# Altium schematic sheet Altera_Stratix_II_Nios_II_Dev_Board.SchDoc: Altera NiosII StratixII Dev Board
size B; DocumentNumber: 1; SheetNumber: 1; SheetTotal: 1
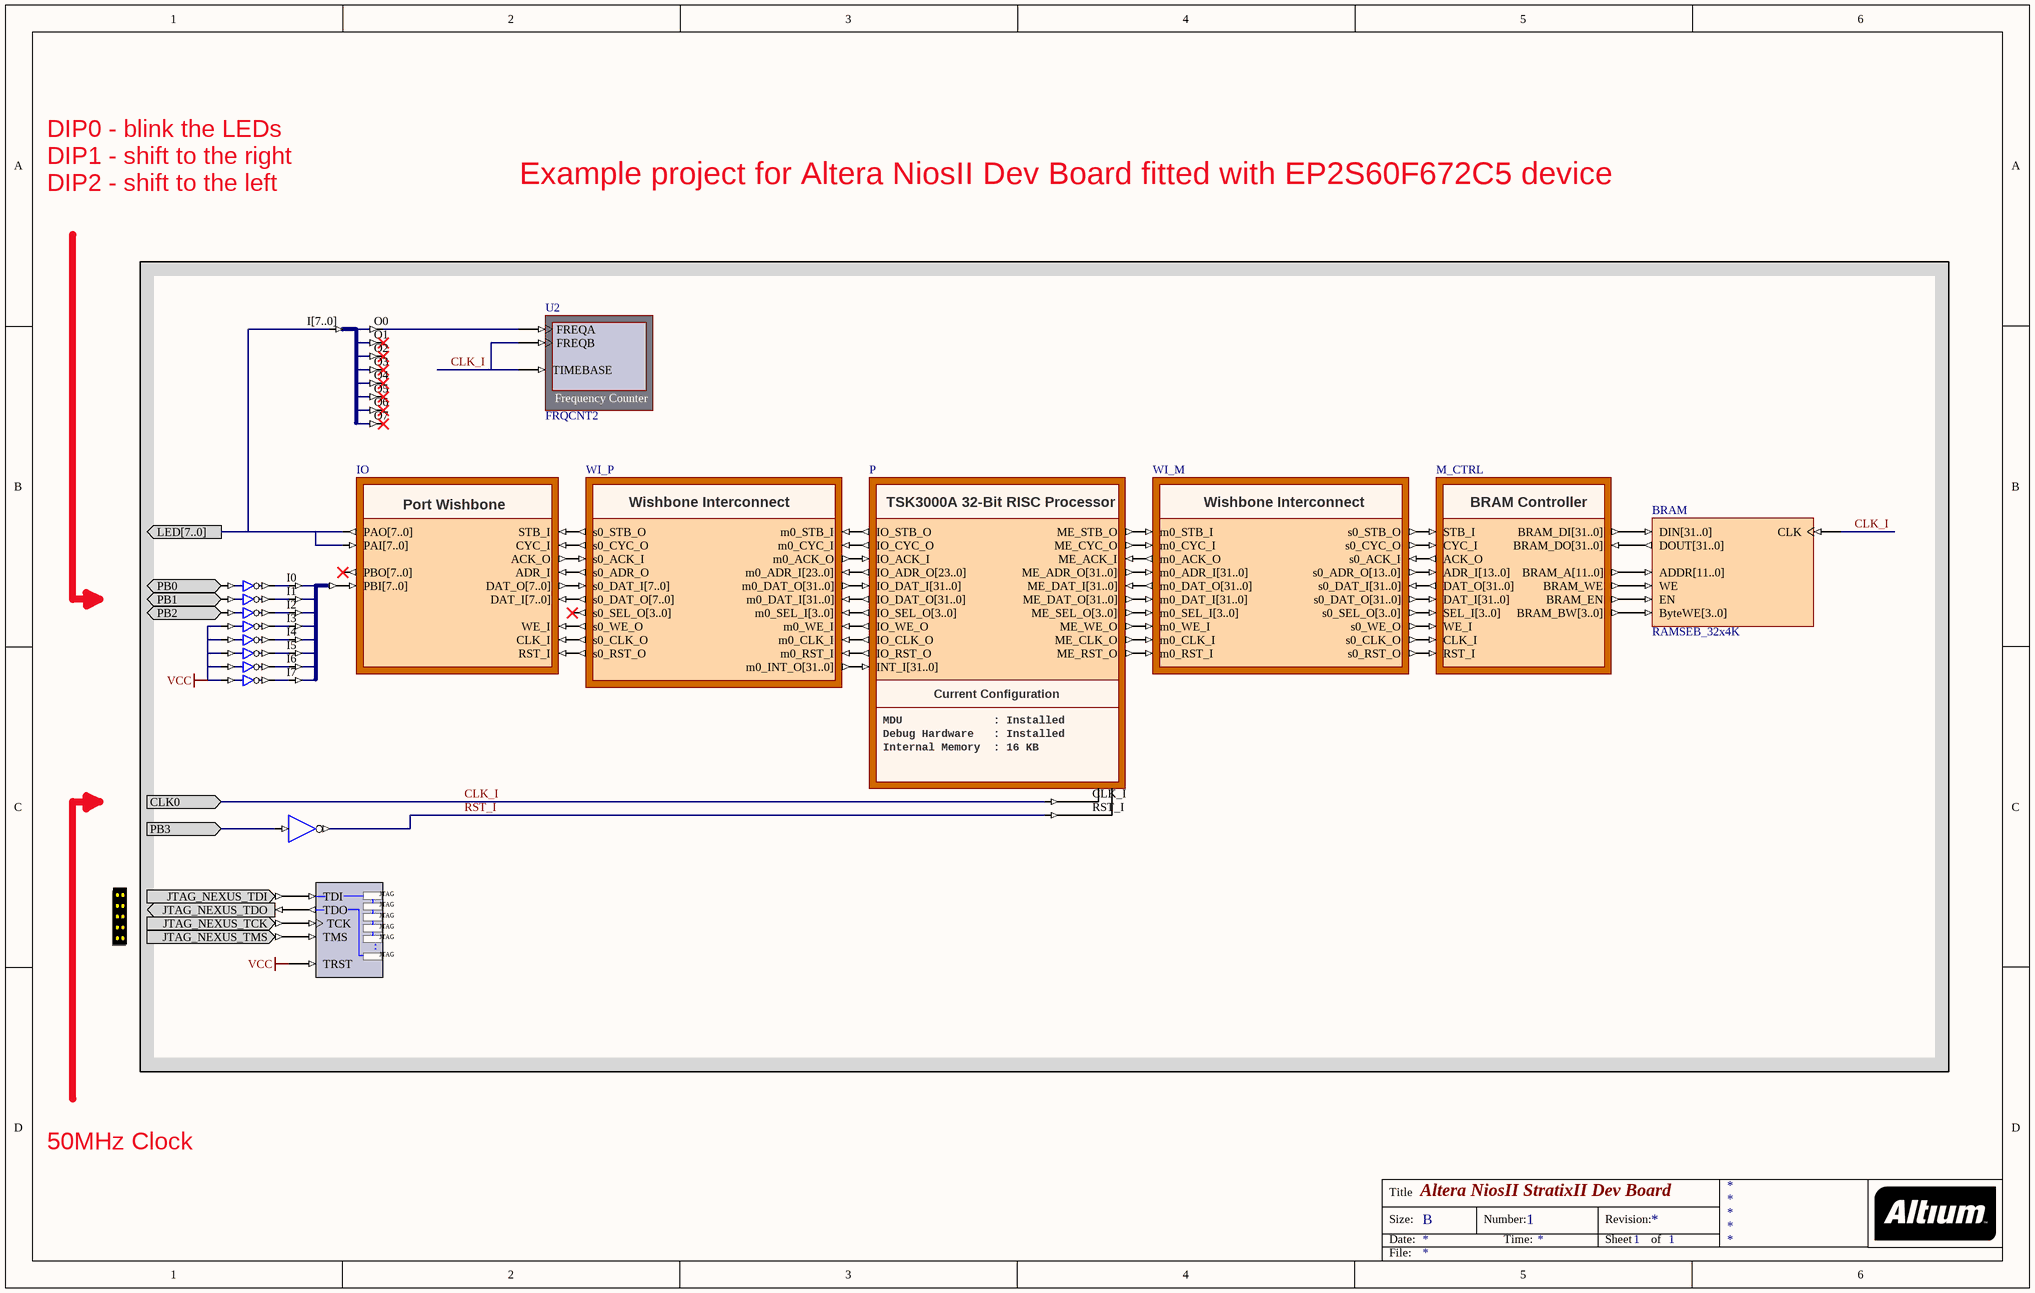
[diagram p0: Altera_Stratix_II_Nios_II_Dev_Board.SchDoc]

## Parts
?  NEXUS_JTAG_CONNECTOR  (value not drawn)
BRAM  RAMSEB_32x4K
IO  WB_PRTIO  (value not drawn)
M_CTRL  WB_MEM_CTRL  (value not drawn)
NEXUS_JTAG_PORT  NEXUS_JTAG_PORT  (value not drawn)
P  TSK3000A  (value not drawn)
U1  J8S_8B  (value not drawn)
U2  FRQCNT2
U3  J8B_8S  (value not drawn)
U4  INV  (value not drawn)
U5  INV8S  (value not drawn)
WI_M  WB_INTERCON  (value not drawn)
WI_P  WB_INTERCON  (value not drawn)

## Ports
CLK0 (in), LED[7..0] (out), PB0 (in), PB1 (in), PB2 (in), PB3 (in)

## Nets
VCC: NEXUS_JTAG_PORT.TRST U5.I3 U5.I4 U5.I5 U5.I6 U5.I7
CLK_I: BRAM.CLK P.CLK_I U2.FREQB U2.TIMEBASE ; port CLK0
LED[7..0]: IO.PAI[7..0] IO.PAO[7..0] U3.I[7..0] ; port LED[7..0]
PB0: U5.I0 ; port PB0
PB1: U5.I1 ; port PB1
PB2: U5.I2 ; port PB2
PB3: U4.I ; port PB3
RST_I: P.RST_I U4.O
Net?_JTAG_NEXUS_TCK: ?.JTAG_NEXUS_TCK NEXUS_JTAG_PORT.TCK
Net?_JTAG_NEXUS_TDI: ?.JTAG_NEXUS_TDI NEXUS_JTAG_PORT.TDI
Net?_JTAG_NEXUS_TDO: ?.JTAG_NEXUS_TDO NEXUS_JTAG_PORT.TDO
Net?_JTAG_NEXUS_TMS: ?.JTAG_NEXUS_TMS NEXUS_JTAG_PORT.TMS
NetBRAM_ADDR[11..0]: BRAM.ADDR[11..0] M_CTRL.BRAM_A[11..0]
NetBRAM_ByteWE[3..0]: BRAM.ByteWE[3..0] M_CTRL.BRAM_BW[3..0]
NetBRAM_DIN[31..0]: BRAM.DIN[31..0] M_CTRL.BRAM_DI[31..0]
NetBRAM_DOUT[31..0]: BRAM.DOUT[31..0] M_CTRL.BRAM_DO[31..0]
NetBRAM_EN: BRAM.EN M_CTRL.BRAM_EN
NetBRAM_WE: BRAM.WE M_CTRL.BRAM_WE
NetIO_ACK_O: IO.ACK_O WI_P.s0_ACK_I
NetIO_ADR_I: IO.ADR_I WI_P.s0_ADR_O
NetIO_CLK_I: IO.CLK_I WI_P.s0_CLK_O
NetIO_CYC_I: IO.CYC_I WI_P.s0_CYC_O
NetIO_DAT_I[7..0]: IO.DAT_I[7..0] WI_P.s0_DAT_O[7..0]
NetIO_DAT_O[7..0]: IO.DAT_O[7..0] WI_P.s0_DAT_I[7..0]
NetIO_PBI[7..0]: IO.PBI[7..0] U1.O[7..0]
NetIO_RST_I: IO.RST_I WI_P.s0_RST_O
NetIO_STB_I: IO.STB_I WI_P.s0_STB_O
NetIO_WE_I: IO.WE_I WI_P.s0_WE_O
NetM_CTRL_ACK_O: M_CTRL.ACK_O WI_M.s0_ACK_I
NetM_CTRL_ADR_I[13..0]: M_CTRL.ADR_I[13..0] WI_M.s0_ADR_O[13..0]
NetM_CTRL_CLK_I: M_CTRL.CLK_I WI_M.s0_CLK_O
NetM_CTRL_CYC_I: M_CTRL.CYC_I WI_M.s0_CYC_O
NetM_CTRL_DAT_I[31..0]: M_CTRL.DAT_I[31..0] WI_M.s0_DAT_O[31..0]
NetM_CTRL_DAT_O[31..0]: M_CTRL.DAT_O[31..0] WI_M.s0_DAT_I[31..0]
NetM_CTRL_RST_I: M_CTRL.RST_I WI_M.s0_RST_O
NetM_CTRL_SEL_I[3..0]: M_CTRL.SEL_I[3..0] WI_M.s0_SEL_O[3..0]
NetM_CTRL_STB_I: M_CTRL.STB_I WI_M.s0_STB_O
NetM_CTRL_WE_I: M_CTRL.WE_I WI_M.s0_WE_O
NetP_INT_I[31..0]: P.INT_I[31..0] WI_P.m0_INT_O[31..0]
NetP_IO_ACK_I: P.IO_ACK_I WI_P.m0_ACK_O
NetP_IO_ADR_O[23..0]: P.IO_ADR_O[23..0] WI_P.m0_ADR_I[23..0]
NetP_IO_CLK_O: P.IO_CLK_O WI_P.m0_CLK_I
NetP_IO_CYC_O: P.IO_CYC_O WI_P.m0_CYC_I
NetP_IO_DAT_I[31..0]: P.IO_DAT_I[31..0] WI_P.m0_DAT_O[31..0]
NetP_IO_DAT_O[31..0]: P.IO_DAT_O[31..0] WI_P.m0_DAT_I[31..0]
NetP_IO_RST_O: P.IO_RST_O WI_P.m0_RST_I
NetP_IO_SEL_O[3..0]: P.IO_SEL_O[3..0] WI_P.m0_SEL_I[3..0]
NetP_IO_STB_O: P.IO_STB_O WI_P.m0_STB_I
NetP_IO_WE_O: P.IO_WE_O WI_P.m0_WE_I
NetP_ME_ACK_I: P.ME_ACK_I WI_M.m0_ACK_O
NetP_ME_ADR_O[31..0]: P.ME_ADR_O[31..0] WI_M.m0_ADR_I[31..0]
NetP_ME_CLK_O: P.ME_CLK_O WI_M.m0_CLK_I
NetP_ME_CYC_O: P.ME_CYC_O WI_M.m0_CYC_I
NetP_ME_DAT_I[31..0]: P.ME_DAT_I[31..0] WI_M.m0_DAT_O[31..0]
NetP_ME_DAT_O[31..0]: P.ME_DAT_O[31..0] WI_M.m0_DAT_I[31..0]
NetP_ME_RST_O: P.ME_RST_O WI_M.m0_RST_I
NetP_ME_SEL_O[3..0]: P.ME_SEL_O[3..0] WI_M.m0_SEL_I[3..0]
NetP_ME_STB_O: P.ME_STB_O WI_M.m0_STB_I
NetP_ME_WE_O: P.ME_WE_O WI_M.m0_WE_I
NetU1_I0: U1.I0 U5.O0
NetU1_I1: U1.I1 U5.O1
NetU1_I2: U1.I2 U5.O2
NetU1_I3: U1.I3 U5.O3
NetU1_I4: U1.I4 U5.O4
NetU1_I5: U1.I5 U5.O5
NetU1_I6: U1.I6 U5.O6
NetU1_I7: U1.I7 U5.O7
NetU2_FREQA: U2.FREQA U3.O0

Not connected (* = marked no-connect by the designer): IO PBO[7..0]*; U3 O1* O2* O3* O4* O5* O6* O7*; WI_P s0_SEL_O[3..0]*

## Notes on the sheet
- DIP0 - blink the LEDs
  DIP1 - shift to the right
  DIP2 - shift to the left
- Example project for Altera NiosII Dev Board fitted with EP2S60F672C5 device
- 50MHz Clock
- Title
- Size:
- Date:
- B
- Number:
- Time:
- Revision:
- Sheet
- of
- File:
- (in symbol NEXUS_JTAG_PORT) .
- (in symbol TSK3000A) TSK3000A 32-Bit RISC Processor; Current Configuration; MDU              : Installed; Debug Hardware   : Installed; Internal Memory  : 16 KB
- (in symbol WB_INTERCON) Wishbone Interconnect
- (in symbol WB_MEM_CTRL) BRAM Controller
- (in symbol WB_PRTIO) Port Wishbone

## Library data of the parts
? = NEXUS_JTAG_CONNECTOR: JTAG Port; PortComponent: True; Published: 19-Nov-2003; Publisher: Altium Limited; HelpURL: TR0102 NanoBoard Technical Reference Manual - NB1.pdf#page=33
BRAM = RAMSEB_32x4K: Single Port RAM, Enable, Byte Write Enable; Memory_Depth: 4096; Memory_Type: RAM_SinglePortBlock; Memory_Width: 32; Memory_ClockEdge: Rising; Nexus_Core: Memory_Program; Memory_EnablePin: True; Published: 11/10/2004; Publisher: Altium Hobart Technology Center; Memory_ByteWrites: True
IO = WB_PRTIO: Configurable Port Wishbone; ChildModel: PRTIO2X8_W; ConfigurationParameters: {}Version[1.0]{}PortCount[2]{}BusWidth[8]{}PortKind[0]{}; ComponentLink1Description: Core &Resource Usage; ComponentLink1URL: CR0139 FPGA Peripheral Resource Usage.pdf#page=63; HelpURL: CR0154 WB_PRTIO Configurable Wishbone Parallel Port Unit.pdf; LastRevisionNo: 1.00.00; Published: 9-Dec-2004; Publisher: Altium Limited; ConfiguratorName: WB_PRTIO
M_CTRL = WB_MEM_CTRL: Configurable Memory Controller; ConfigurationParameters: {}Version[1.0]{}Option_MemoryType[Block RAM]{}Option_MemorySize[16 Kb (4K x 32-bit)]{}Option_Layout[2 x 16-bit Wide Devices]{}Option_Read[2]{}Option_WriteSetup[1]{}Option_WritePulse[1]{}Option_WriteHold[1]{}; ComponentLink1Description: Core &Resource Usage; ComponentLink1URL: CR0139 FPGA Peripheral Resource Usage.pdf#page=58; HelpURL: CR0152 WB_MEM_CTRL Configurable Wishbone Memory Controller.pdf; LastRevisionNo: 1.00.00; Published: 9-Dec-2004; Publisher: Altium Limited; ConfiguratorName: WB_MEM_CTRL
NEXUS_JTAG_PORT = NEXUS_JTAG_PORT: Soft Nexus-Chain Connector; NEXUS_JTAG_CONNECTOR: True; FunctionalClass: JTAG; Published: 29-Jan-2004; Publisher: Altium Limited; LastRevisionNo: 1.00.00; HelpURL: CR0118 FPGA Generic Library Guide.pdf#page=405
P = TSK3000A: TSK3000A OCD Microprocessor; ChildModel1: TSK3000A_MCU; Nexus_JTAG_Device: True; Nexus_Core: Processor_OCDS; Nexus_JTAG_Order: 0; ChildModel2: TSK3000A_MDU; ChildModel3: TSK3000A_OCDS; ChildModel4: TSK3000A_Shift_Barrel; ChildModel5: TSK3000A_Shift_Sequential; ChildModel6: Mult_32x32; ConfigurationParameters: {}Version[1.0]{}Option_Processor[0]{}Option_Memory[4]{}Option_MDU[0]{}Option_OCDS[0]{}Option_Shifter[0]{}Option_InterruptCount[32]{}Option_DebugWhenReset[0]{}; ChildModel7: m33x33; ConfiguratorName: FPGA_MCU32; Memory_Configuration: Record[PERIPHERAL]{}ComponentDesignator[IO]{}Memory_Depth[0x0002]{}Memory_UsageType[rom]{}ProgramDownloadAddress[0xFF000000]{}Memory_BusType[TSK3000:addr_bus]{}Memory_Mau[8]{}Memory_MatchedComponent[]{}Memory_Description[WI_P]{}Memory_FillBitPattern[]{}Memory_Interrupts[]{n}Record[CODE_EXPORT]{}ExportType[]{n}Record[NEXUS_CORE]{}ComponentDesignator[irom]{}Memory_Depth[8K]{}Memory_UsageType[rom]{}ProgramDownloadAddress[0]{}Memory_BusType[TSK3000:addr_bus]{}Memory_Mau[8]{}Memory_MatchedComponent[]{}Memory_Description[]{}Memory_FillBitPattern[]{}Memory_Interrupts[]{n}Record[NEXUS_CORE]{}ComponentDesignator[xrom]{}Memory_Depth[8K]{}Memory_UsageType[rom]{}ProgramDownloadAddress[0x1000000]{}Memory_BusType[TSK3000:addr_bus]{}Memory_Mau[8]{}Memory_MatchedComponent[]{}Memory_Description[WI_M]{}Memory_FillBitPattern[]{}Memory_Interrupts[]{n}Record[NEXUS_CORE]{}ComponentDesignator[iram]{}Memory_Depth[8K]{}Memory_UsageType[ram]{}ProgramDownloadAddress[8K]{}Memory_BusType[TSK3000:addr_bus]{}Memory_Mau[8]{}Memory_MatchedComponent[]{}Memory_Description[]{}Memory_FillBitPattern[]{}Memory_Interrupts[]{n}Record[NEXUS_CORE]{}ComponentDesignator[xram]{}Memory_Depth[8K]{}Memory_UsageType[ram]{}ProgramDownloadAddress[0x01002000]{}Memory_BusType[TSK3000:addr_bus]{}Memory_Mau[8]{}Memory_MatchedComponent[]{}Memory_Description[]{}Memory_FillBitPattern[]{}Memory_Interrupts[]{n}; ProgramLogicalTopAddress: 0; ComponentLink1Description: Core &Resource Usage; ComponentLink1URL: CR0140 FPGA Processor Resource Usage.pdf#page=20; HelpURL: CR0121 TSK3000A 32 bit RISC Processor.pdf; LastRevisionNo: 1.00.00; Published: 17-Nov-2004; Publisher: Altium Limited; ComponentLink2Description: Embedded &Tools Guide; ComponentLink2URL: GU0111 Using the TSK3000 Embedded Tools.pdf; ComponentLink3Description: Embedded T&echnical References; ComponentLink3URL: TR0109 TSK3000 Embedded Tools Reference.pdf
U1 = J8S_8B: 8 Single pin inputs to single 8-Bit output bus; FunctionalClass: Bus Joiner; PortSize: 8; ArchiveName: GENERIC; VHDLIB_SIM: GENERIC_LIB; Published: 29-Jan-2004; Publisher: Altium Limited; LastRevisionNo: 1.00.00; HelpURL: CR0118 FPGA Generic Library Guide.pdf#page=306; ComponentLink1URL: CR0126 FPGA Bus Joiner Resource Usage.pdf#page=28; ComponentLink1Description: Core &Resource Usage
U2 = FRQCNT2: Frequency Counter; NEXUS_CORE: Instrument; NEXUS_JTAG_DEVICE: True; NEXUS_JTAG_ORDER: 0; Published: 3-Nov-2004; Publisher: Altium Limited; Core Revision: 1.00.00; ComponentLink1Description: Core &Resource Usage; ComponentLink1URL: CR0134 FPGA Instrument Resource Usage.pdf#page=3; HelpURL: CR0101 FRQCNT2 Frequency Counter.pdf; LastRevisionNo: 1.00.00
U3 = J8B_8S: 8-Bit input bus to 8 single pin outputs; FunctionalClass: Bus Joiner; PortSize: 8; ArchiveName: GENERIC; VHDLIB_SIM: GENERIC_LIB; Published: 29-Jan-2004; Publisher: Altium Limited; LastRevisionNo: 1.00.00; HelpURL: CR0118 FPGA Generic Library Guide.pdf#page=304; ComponentLink1URL: CR0126 FPGA Bus Joiner Resource Usage.pdf#page=27; ComponentLink1Description: Core &Resource Usage
U4 = INV: Inverter; FunctionalClass: Logic Primitive; ArchiveName: GENERIC; VHDLIB_SIM: GENERIC_LIB; Published: 29-Jan-2004; Publisher: Altium Limited; XilinxEquivalent: INV; LastRevisionNo: 1.00.00; HelpURL: CR0118 FPGA Generic Library Guide.pdf#page=291; ComponentLink1URL: CR0136 FPGA Logic Primitive Resource Usage.pdf#page=61; ComponentLink1Description: Core &Resource Usage; SubClass: INV
U5 = INV8S: 8-Bit Inverter, Single Pin Version; FunctionalClass: Logic Primitive; SubClass: INV; PortSize: 8; ArchiveName: GENERIC; VHDLIB_SIM: GENERIC_LIB; Published: 29-Jan-2004; Publisher: Altium Limited; LastRevisionNo: 1.00.00; HelpURL: CR0118 FPGA Generic Library Guide.pdf#page=291; ComponentLink1URL: CR0136 FPGA Logic Primitive Resource Usage.pdf#page=75; ComponentLink1Description: Core &Resource Usage; PortStyle: Single Pin Version
WI_M = WB_INTERCON: Configurable Wishbone Interconnect; ConfigurationParameters: {}Version[1.0]{}UnusedInterrupts[2]{}MasterAddressBits[0]{}Name0[BRAM]{}Kind0[2]{}SpaceAfter0[14]{}Address_Base0[16777216]{}Address_UsedRange0[524288]{}Address_Bits0[14]{}Address_Mode0[1]{}Address_DecodeWidth0[8]{}DataWidth0[0]{}UsedInterrupts0[ ]; ComponentLink1Description: Core &Resource Usage; ComponentLink1URL: CR0139 FPGA Peripheral Resource Usage.pdf#page=52; HelpURL: CR0150 WB_INTERCON Configurable Wishbone Interconnect.pdf; LastRevisionNo: 1.00.00; Published: 9-Dec-2004; Publisher: Altium Limited; ConfiguratorName: WB_INTERCON
WI_P = WB_INTERCON: Configurable Wishbone Interconnect; ConfigurationParameters: {}Version[1.0]{}UnusedInterrupts[1]{}MasterAddressBits[1]{}Name0[IO]{}Kind0[2]{}SpaceAfter0[14]{}Address_Base0[-16777216]{}Address_UsedRange0[524288]{}Address_Bits0[1]{}Address_Mode0[1]{}Address_DecodeWidth0[8]{}DataWidth0[2]{}UsedInterrupts0[ ]; ComponentLink1Description: Core &Resource Usage; ComponentLink1URL: CR0139 FPGA Peripheral Resource Usage.pdf#page=52; HelpURL: CR0150 WB_INTERCON Configurable Wishbone Interconnect.pdf; LastRevisionNo: 1.00.00; Published: 9-Dec-2004; Publisher: Altium Limited; ConfiguratorName: WB_INTERCON